# Altium schematic sheet PressureTransducer.SchDoc
size A4
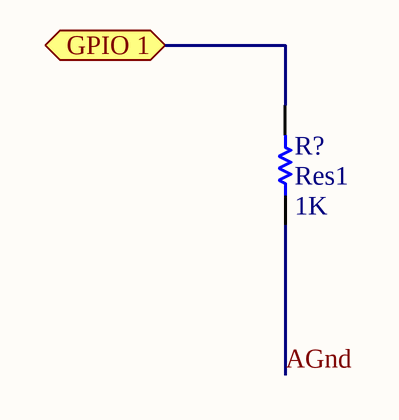
[diagram p0: PressureTransducer.SchDoc]

## Parts
R?  Res1  value 1K  [AXIAL-0.3]

## Ports
GPIO 1

## Nets
AGnd: R?.1
GPIO 1: R?.2 ; port GPIO 1

## Library data of the parts
R? = Res1: Resistor; Published: 8-Jun-2000; LatestRevisionDate: 17-Jul-2002; LatestRevisionNote: Re-released for DXP Platform.; PackageReference: AXIAL-0.3; Publisher: Altium Limited; PackageDescription: Axial Device, Thru-Hole; 2 Leads; 0.3 in Pin Spacing